# EasyEDA schematic pickup.json
TITLE: Sheet_1; REV: 1.0; Date: 2023-07-27; Sheet: 1/1; Company: Your Company
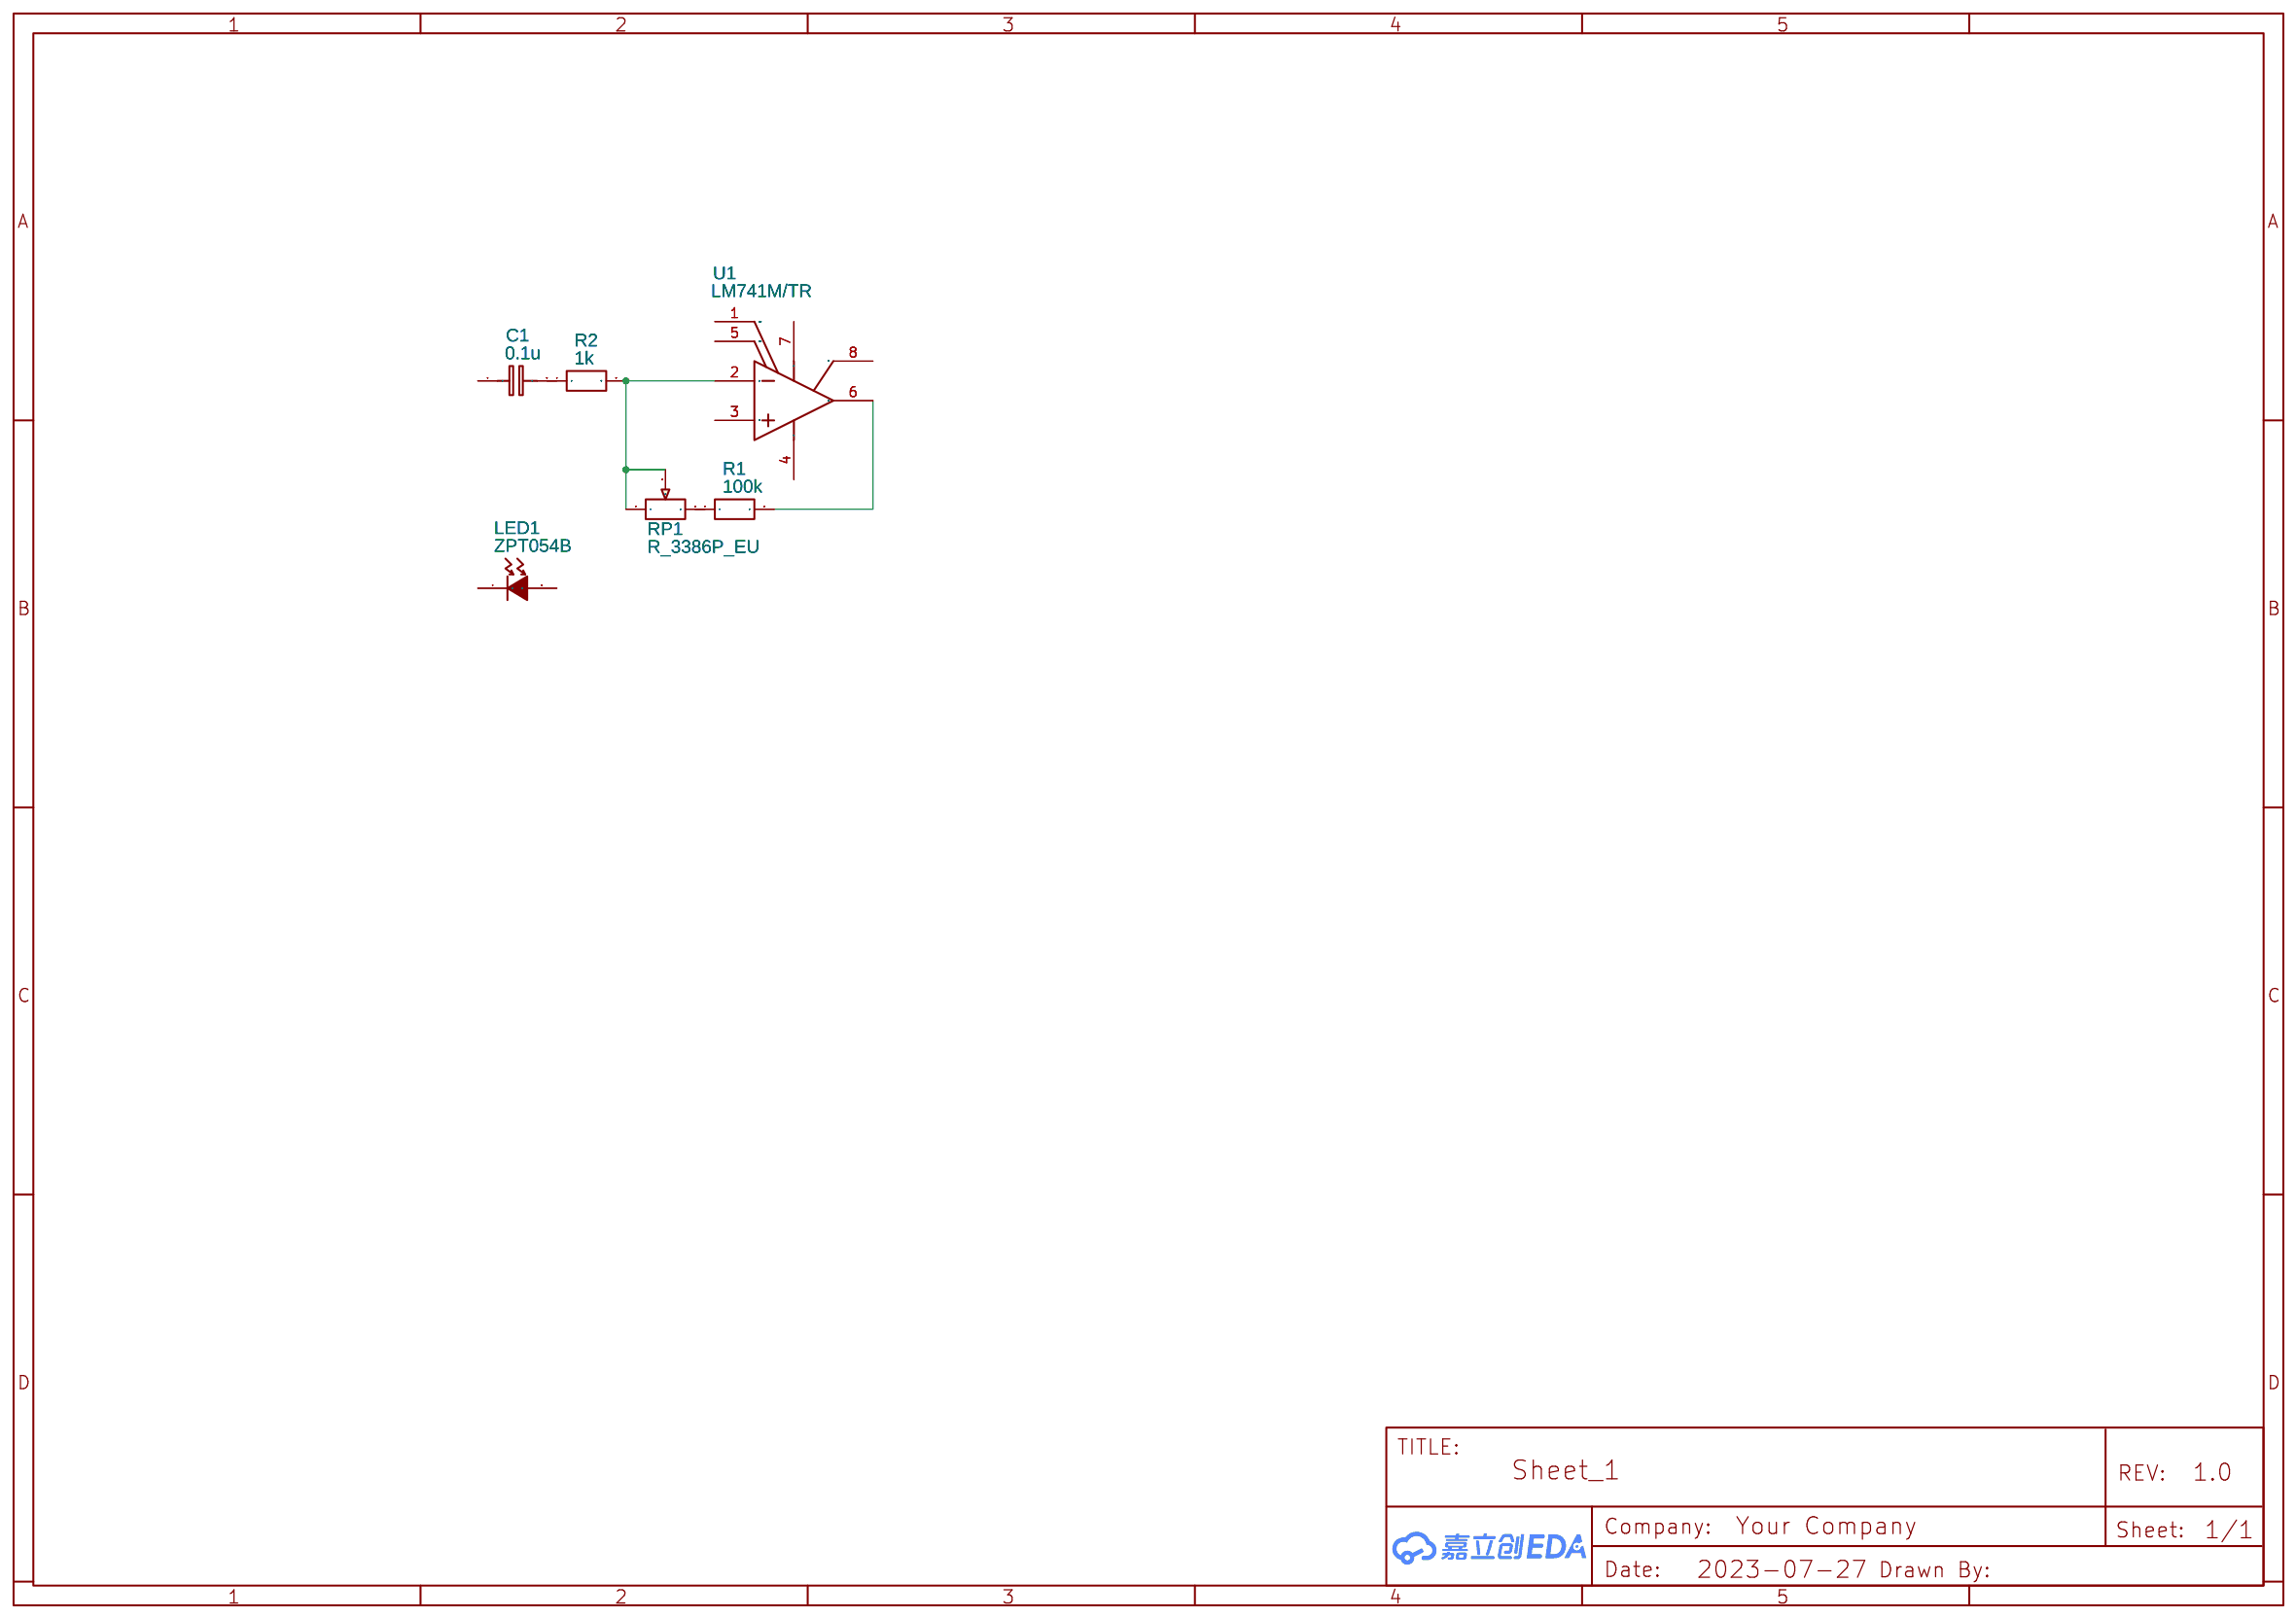
[diagram p0: schematic sheet]

## Parts
C1  0.1u  [C0603]
LED1  ZPT054B  [LED-TH_BD5.9-RD_DY-PT334-6B]
R1  100k  [R0603]
R2  1k  [R0603]
RP1  R_3386P_EU  [RES-ADJ-TH_3386P]
U1  LM741M/TR  [SOP-8_L4.9-W3.9-P1.27-LS6.0-BL]

## Library data of the parts
C1 = C_0603_EU: Contributor: LCEDA_Lib
LED1 = ZPT054B: Contributor: LCSC; Supplier: LCSC; Supplier Part: C575323; Manufacturer: Chau Light; JLCPCB Part Class: Extended Part
R1 R2 = R_0603_EU: Contributor: LCEDA_Lib
RP1 = R_3386P_EU: Supplier: LCSC; Contributor: LCEDA_Lib; Value(Ω): 10K
U1 = LM741M/TR: Contributor: LCSC; Supplier: LCSC; Supplier Part: C356704; Manufacturer: HGSEMI(华冠); JLCPCB Part Class: Extended Part

## Nets
Net-(R1-2): R1.2 U1.6(OUT)
Net-(R2-2): R2.2 RP1.1 RP1.2 U1.2(IN-)

Not connected (* = marked no-connect by the designer): C1 1 2; LED1 1(E) 2(C); R1 1; R2 1; RP1 3; U1 1(OFFSET_NULL) 3(IN+) 4(V-) 5(OFFSET_NULL) 7(V+) 8(NC)
